# Altium schematic sheet memory.SchDoc
size A
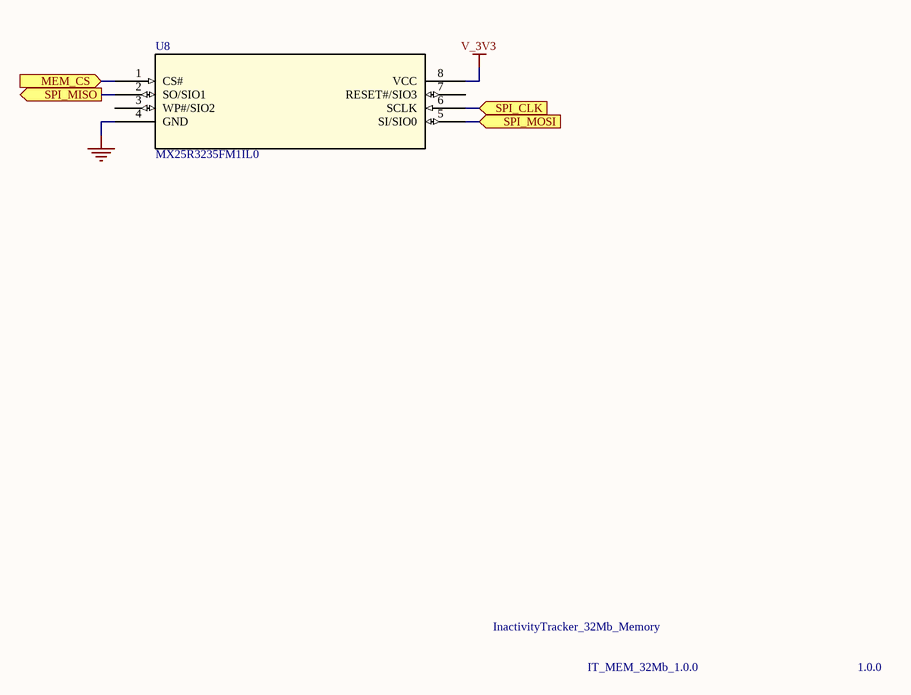
[diagram p0: memory.SchDoc]

## Parts
U8  MX25R3235FM1IL0  [SOP_8L_150]

## Ports
MEM_CS (in), SPI_CLK (in), SPI_MISO (out), SPI_MOSI (in)

## Nets
GND: U8.4(GND)
V_3V3: U8.8(VCC)
MEM_CS: U8.1(CS#) ; port MEM_CS
SPI_CLK: U8.6(SCLK) ; port SPI_CLK
SPI_MISO: U8.2(SO/SIO1) ; port SPI_MISO
SPI_MOSI: U8.5(SI/SIO0) ; port SPI_MOSI

Not connected (* = marked no-connect by the designer): U8 3(WP#/SIO2) 7(RESET#/SIO3)

## Notes on the sheet
- InactivityTracker_32Mb_Memory
- IT_MEM_32Mb_1.0.0
- 1.0.0

## Library data of the parts
U8 = MX25R3235FM1IL0: FLASH - NOR Memory IC 32Mb (4M x 8) SPI 80MHz 8-SOP; Vendor: Macronix; Built_By: EMA_Cory; Manufacturer_Part_Number: MX25R3235FM1IL0; Copyright: Copyright (C) 2018 Accelerated Designs. All rights reserved; RefDes: RefDes; Type: DEV; Value: Value